# Altium schematic sheet imp_match_v1.SchDoc
size OrCAD E
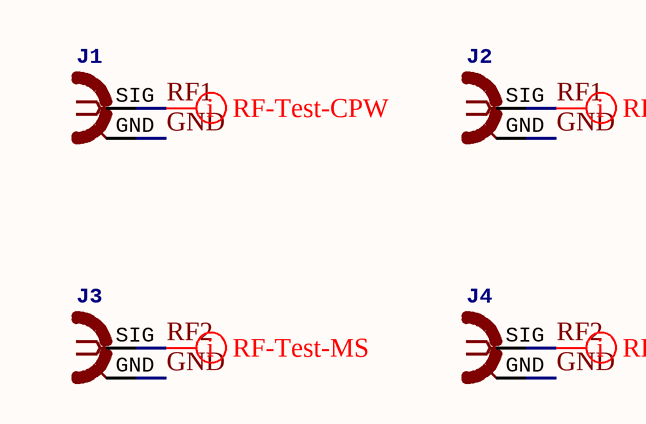
[diagram p0: imp_match_v1.SchDoc]

## Parts
J1  SMA 50 Ohm edge  [SMA-OSHPARK-4L-1.6MM]  (value not drawn)
J2  SMA 50 Ohm edge  [SMA-OSHPARK-4L-1.6MM]  (value not drawn)
J3  SMA 50 Ohm edge  [SMA-OSHPARK-4L-1.6MM]  (value not drawn)
J4  SMA 50 Ohm edge  [SMA-OSHPARK-4L-1.6MM]  (value not drawn)

## Nets
GND: J1.GND J2.GND J3.GND J4.GND
RF1: J1.SIG J2.SIG
RF2: J3.SIG J4.SIG

## Layout directives
rule Width Constraint [Pref Width = 12.017mil    Min Width = 12.017mil    Max Width = 12.017mil]; rule Clearance Constraint [Generic clearance = 10mil, and 9 value(s) for objects]: RF1
rule Width Constraint [Pref Width = 12.629mil    Min Width = 12.629mil    Max Width = 12.629mil]; rule Clearance Constraint [Generic clearance = 10mil, and 9 value(s) for objects]: RF2

## Library data of the parts
J1-J4 = SMA-OSHPARK-4L-1.6MM: GateName_1: G1; SymbolName_1: COAX; DeviceName: -OSHPARK-4L-1.6MM; LibraryName: dword1511-connectors; DeviceSetName: SMA; Package: SMA-OSHPARK-4L-1.6MM